# EAGLE design simplePDschematicsv2_AZ_SMD (EAGLE 7.5.0)
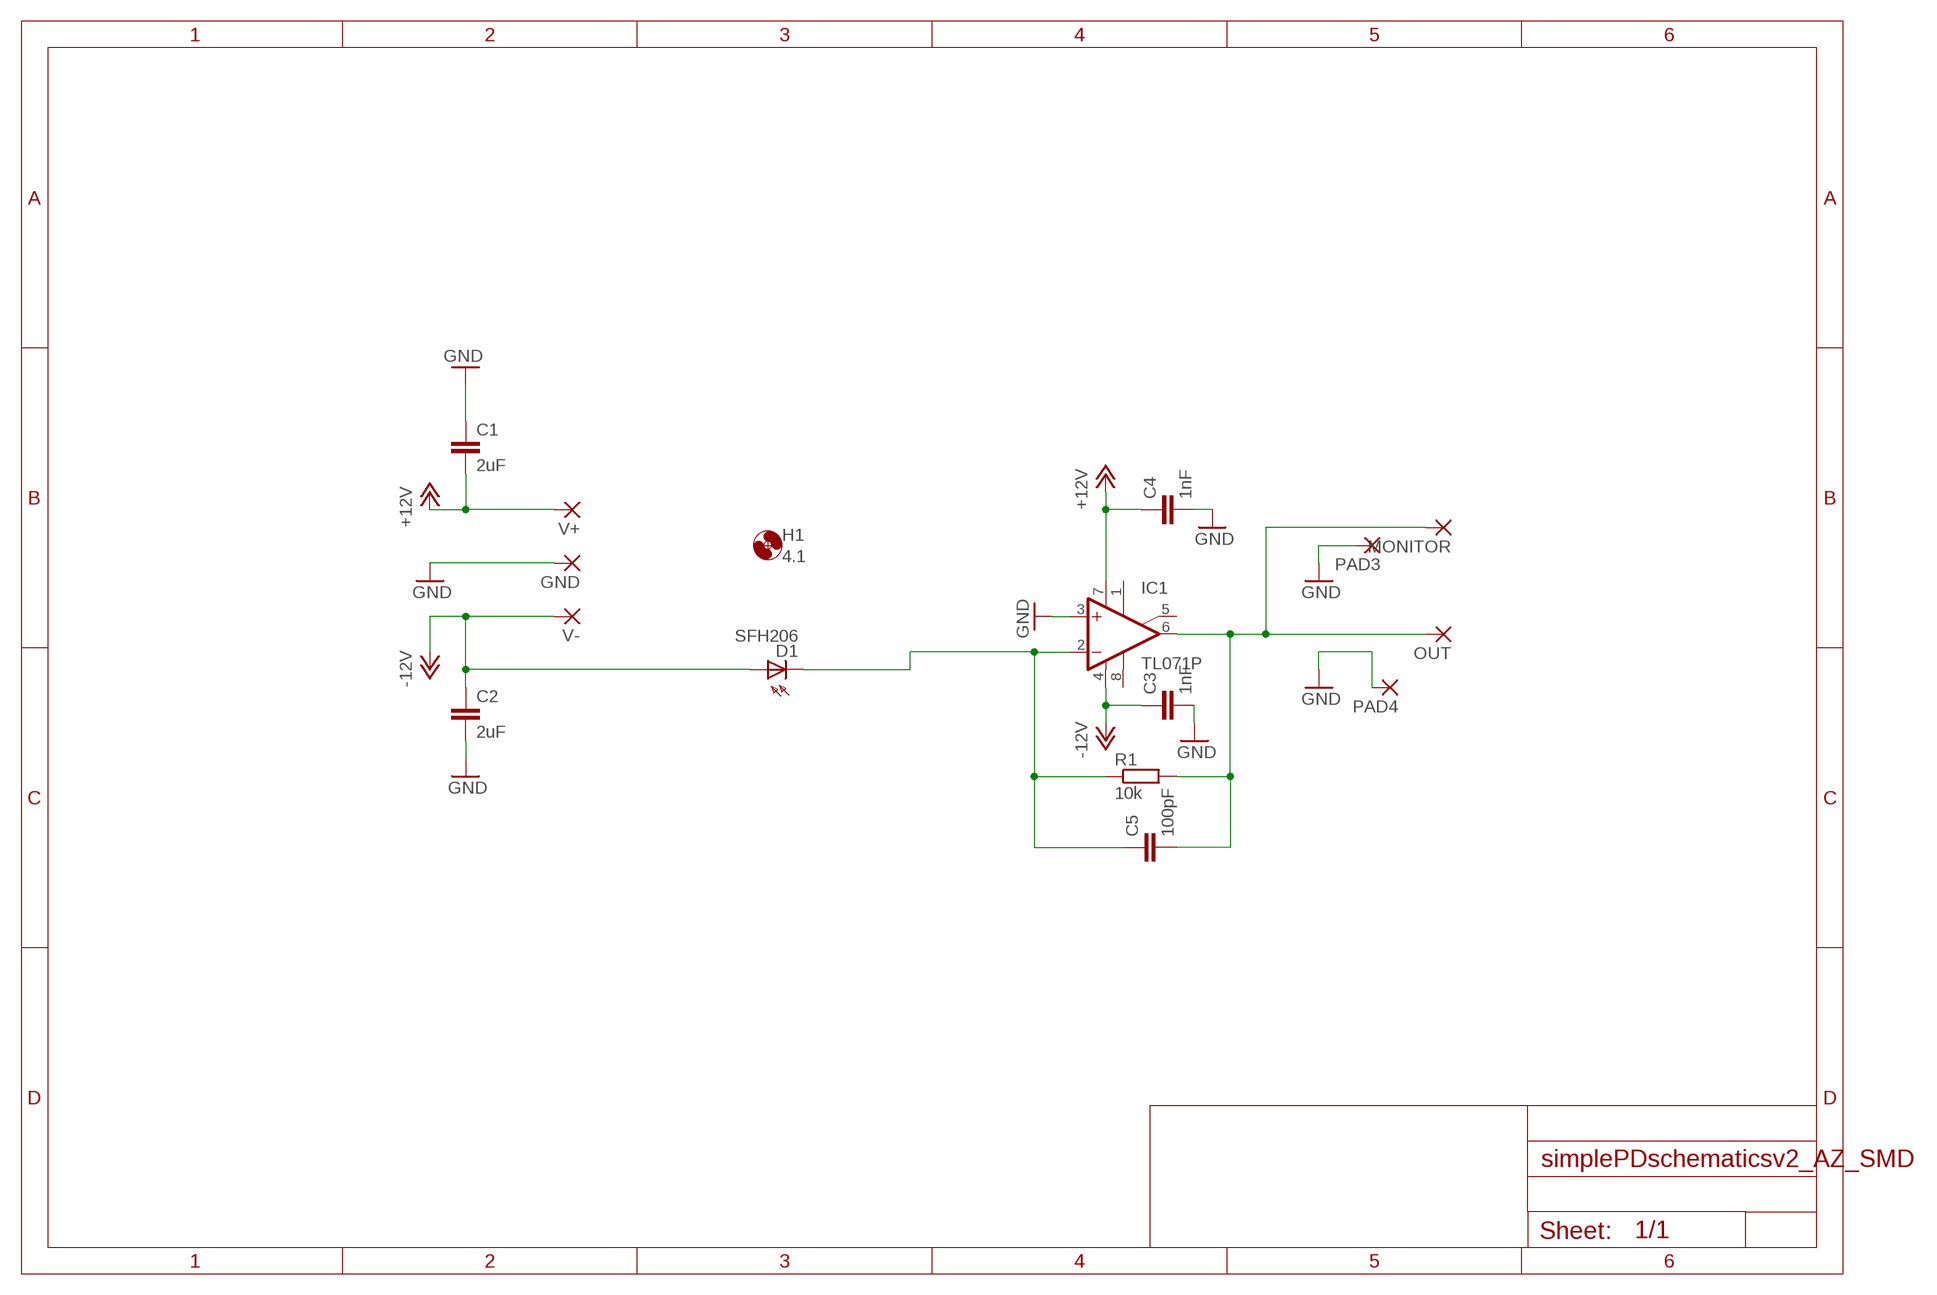
[diagram p0: schematic, sheet 1]

## Parts
C1  2uF  C-EU050-075X075  [C050-075X075]
C2  2uF  C-EU050-075X075  [C050-075X075]
C3  1nF  C-EU025-050X050  [C025-050X050]
C4  1nF  C-EU025-050X050  [C025-050X050]
C5  100pF  C-EU025-050X050  [C025-050X050]
D1  SFH206  [SFH206]
GND  1,6/0,9  [1,6/0,9]
H1  4.1  MOUNT-HOLE4.1  [4,1]
IC1  TL071P  [DIL08]
MONITOR  1,6/0,9  [1,6/0,9]
OUT  1,6/0,9  [1,6/0,9]
PAD3  1,6/0,9  [1,6/0,9]
PAD4  1,6/0,9  [1,6/0,9]
R1  10k  R-EU_M1206  [M1206]
V+  1,6/0,9  [1,6/0,9]
V-  1,6/0,9  [1,6/0,9]

## Nets
GND: C1.1 C2.2 C3.2 C4.2 GND.1(P) IC1.3(+IN) PAD3.1(P) PAD4.1(P)
N$2: C5.2 IC1.6(OUT) MONITOR.1(P) OUT.1(P) R1.2
N$3: C5.1 D1.K(C) IC1.2(-IN) R1.1
V+: C1.2 C4.1 IC1.7(V+) V+.1(P) ; supply symbol labelled +12V
V-: C2.1 C3.1 D1.A IC1.4(V-) V-.1(P) ; supply symbol labelled -12V
Unconnected: IC1.1(ON1) IC1.5(ON2) IC1.8(OPT)

## Library data of the parts
C1-C5 = resistor:C-EU: CAPACITOR, European symbol
D1 = opto-trans-siemens:SFH206: PHOTO DIODE; MPN: SFH206K; OC_FARNELL: 1212741; OC_NEWARK: 01M8807
GND MONITOR OUT PAD3 PAD4 V+ V- = wirepad:1,6/0,9: THROUGH-HOLE PAD
H1 = holes:MOUNT-HOLE: MOUNTING HOLE with drill center marker
IC1 = linear:TL071: OP AMP
R1 = resistor:R-EU_: RESISTOR, European symbol

## Board
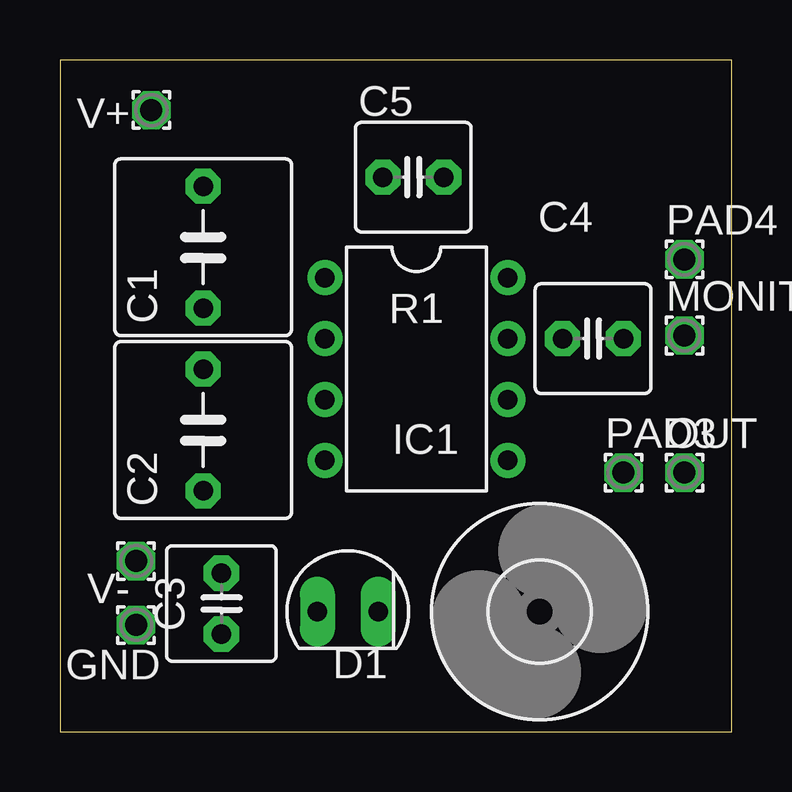
[diagram p1: board, top side]
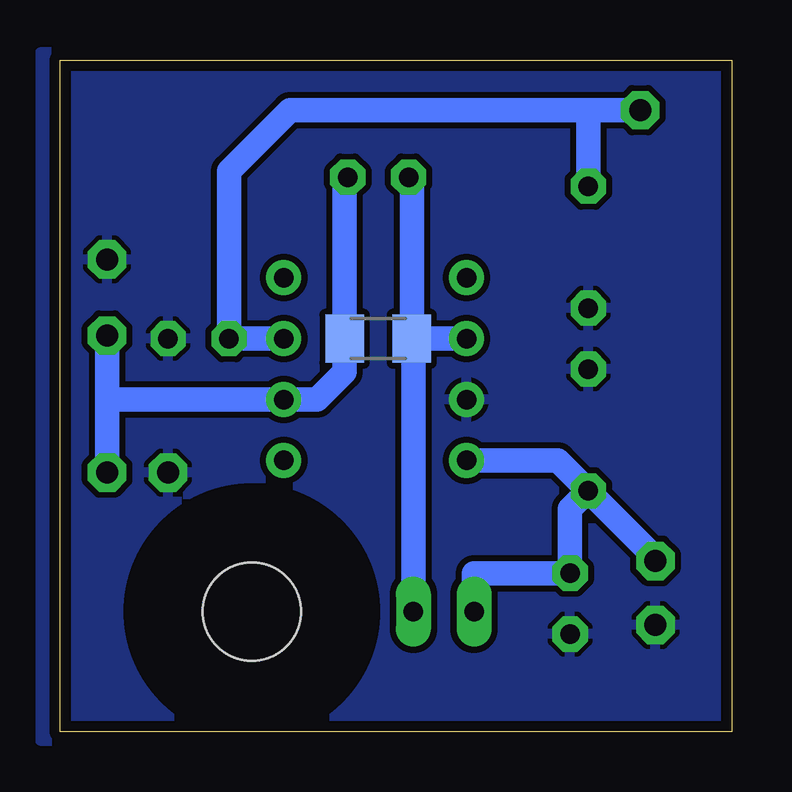
[diagram p2: board, bottom side, seen from below]

Size 28 x 28 mm. Coordinates in mm from the lower left corner, seen from the top.
Outline: 0,0 28,0 28,28 0,28 0,0
Copper layers 16: Bottom 0.035mm
Design rules "eC-STANDARD-pool-1-layer": minimum track width 0.15mm, minimum drill 0.25mm, track to track 0.2mm, track to pad 0.2mm, pad to pad 0.2mm, via to via 0.2mm, smd to smd 0.2mm, copper to edge 0.45mm, drill to drill 0.3mm, minimum pad ring 0.325mm, minimum via ring 0.325mm, stop-mask expansion 0.1mm, vias tented up to drill 0mil, thermal gap 0.2mm

### Footprints (pad centres in the part's own frame; a part is rotated, then mirrored left to right if it is on the bottom)
C050-075X075 = drill 0.813 octagon: 1 -2.54,0; 2 2.54,0
C025-050X050 = drill 0.813 octagon: 1 -1.27,0; 2 1.27,0
SFH206 = drill 0.813 long: A 0,-1.27; K 0,1.27
1,6/0,9 = drill 0.914 pad 1.6 octagon: 1 0,0
4,1 = hole 4.1: 0,0
DIL08 = drill 0.813 pad 1.27: 1 -3.81,-3.81; 2 -1.27,-3.81; 3 1.27,-3.81; 4 3.81,-3.81; 5 3.81,3.81; 6 1.27,3.81; 7 -1.27,3.81; 8 -3.81,3.81
M1206 = smd 1.6 x 2: 1 -1.4,0; 2 1.4,0

### Placement (x,y rotation side)
C1  5.97,20.19 90 top
C2  5.97,12.57 90 top
C3  6.73,5.33 270 top
C4  22.23,16.38 0 top
C5  4,7pF  [C025-050X050]  14.73,23.11 0 top
D1  12,5 270 top
GND  3.17,4.45 180 top
H1  20,5 0 top
IC1  14.86,15.11 270 top
MONITOR  26.04,16.51 0 top
OUT  26.04,10.79 0 top
PAD3  23.5,10.79 0 top
PAD4  26.04,19.68 0 top
R1  14.73,16.38 180 bottom
V+  3.81,25.91 180 top
V-  3.17,7.11 180 top

### Tracks (layer width: path | path; a pad name or v marks a point on that pad's centre or on a via)
GND
  pour Bottom (isolate 0.254): -0.38,28.32 28.83,28.32 28.83,-0.38 -0.38,-0.38
N$2
  Bottom 1.016: 26.04,13.84 IC1.6 17.27,13.84 16.13,14.98 R1.2 16.13,22.98 C5.2 | OUT.1 26.04,13.84 | MONITOR.1 26.04,13.84
N$3
  Bottom 1.016: R1.1 IC1.2 | C5.1 13.33,22.98 R1.1 | R1.1 13.27,16.38 D1.K
V+
  Bottom 1.016: IC1.7 C4.1 20.95,23.37 18.41,25.91 5.97,25.91 | V+.1 5.97,25.91 | C1.2 5.97,25.91
V-
  Bottom 1.016: C2.1 7.24,11.3 IC1.4 10.73,11.3 | V-.1 3.17,7.24 C2.1 | C2.1 6.73,9.27 C3.1 10.73,6.6 D1.A